# EAGLE design RasPi-BplusHAT (EAGLE 7.5.0)
PiHome Serial Gateway Header Schematic
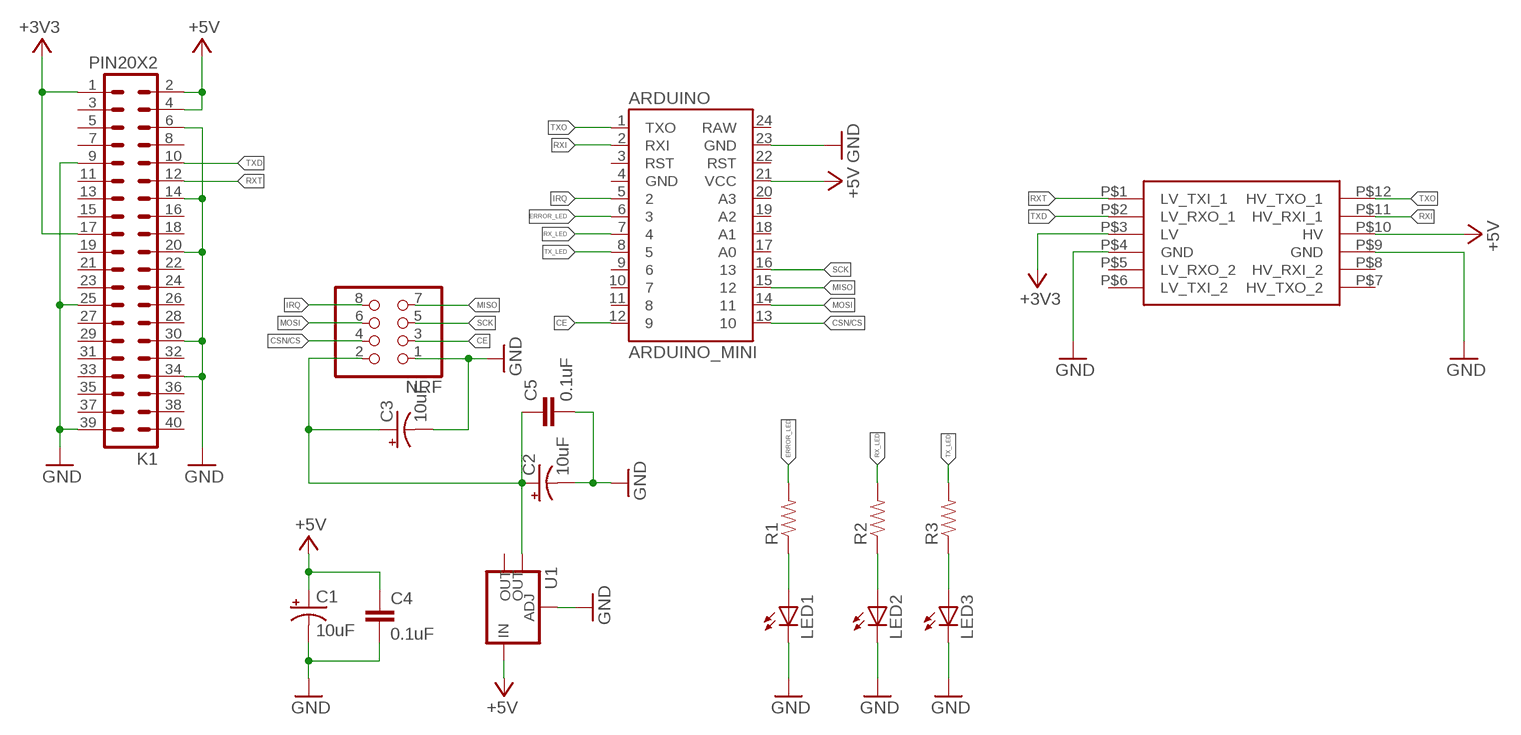
[diagram p0: schematic, sheet 1]

## Parts
ARDUINO  ARDUINO_MINI  [ARDUINO_MINI]
C1  10uF  CAP_POLPTH2  [CPOL-RADIAL-10UF-25V]
C2  10uF  CAP_POLPTH2  [CPOL-RADIAL-10UF-25V]
C3  10uF  CAP_POLPTH2  [CPOL-RADIAL-10UF-25V]
C4  0.1uF  CAPPTH  [CAP-PTH-SMALL]
C5  0.1uF  CAPPTH  [CAP-PTH-SMALL]
K1  PIN20X2  [PIN_20X2]
LED1  LED3MM  [LED3MM]
LED2  LED3MM  [LED3MM]
LED3  LED3MM  [LED3MM]
NRF  PINHD-2X4  [2X04]
R1  RESISTORPTH-1/4W  [AXIAL-0.4]
R2  RESISTORPTH-1/4W  [AXIAL-0.4]
R3  RESISTORPTH-1/4W  [AXIAL-0.4]
U1  V_REG_LM1117SOT223  [SOT223]
U$2  LOGIC_LEVEL_CONVERTER  [LOGIC_LEVEL_CONVERTER]

## Nets
+3V3: K1.1 K1.17 U$2.P$3(LV)
+5V: ARDUINO.21(VCC) C1.1(+) C4.1 K1.2 K1.4 U1.3(IN) U$2.P$10(HV)
CE: ARDUINO.12 NRF.3
CSN/CS: ARDUINO.13 NRF.4
ERROR_LED: ARDUINO.6 R1.P$2
GND: ARDUINO.23(GND) C1.2(-) C2.2(-) C3.2(-) C4.2 C5.2 K1.6 K1.9 K1.14 K1.20 K1.25 K1.30 K1.34 K1.39 LED1.K(C) LED2.K(C) LED3.K(C) NRF.1 U1.1(ADJ) U$2.P$4(GND) U$2.P$9(GND)
IRQ: ARDUINO.5 NRF.8
MISO: ARDUINO.15 NRF.7
MOSI: ARDUINO.14 NRF.6
N$1: C2.1(+) C3.1(+) C5.1 NRF.2 U1.4(OUT)
N$3: LED1.A R1.P$1
N$4: LED2.A R2.P$1
N$5: LED3.A R3.P$1
RX_LED: ARDUINO.7 R2.P$2
RXI: ARDUINO.2(RXI) U$2.P$11(HV_RXI_1)
RXT: K1.12 U$2.P$1(LV_TXI_1)
SCK: ARDUINO.16 NRF.5
TX_LED: ARDUINO.8 R3.P$2
TXD: K1.10 U$2.P$2(LV_RXO_1)
TXO: ARDUINO.1(TXO) U$2.P$12(HV_TXO_1)
Unconnected: ARDUINO.3(RST) ARDUINO.4(GND) ARDUINO.9 ARDUINO.10 ARDUINO.11 ARDUINO.17(A0) ARDUINO.18(A1) ARDUINO.19(A2) ARDUINO.20(A3) ARDUINO.22(RST) ARDUINO.24(RAW) K1.3 K1.5 K1.7 K1.8 K1.11 K1.13 K1.15 K1.16 K1.18 K1.19 K1.21 K1.22 K1.23 K1.24 K1.26 K1.27 K1.28 K1.29 K1.31 K1.32 K1.33 K1.35 K1.36 K1.37 K1.38 K1.40 U1.2(OUT) U$2.P$5(LV_RXO_2) U$2.P$6(LV_TXI_2) U$2.P$7(HV_TXO_2) U$2.P$8(HV_RXI_2)

## Library data of the parts
ARDUINO = SparkFun-Boards:ARDUINO_MINI: Arduino Pro Mini footprint
C1-C3 = SparkFun-Passives:CAP_POL: Capacitor Polarized These are standard SMD and PTH capacitors. Normally 10uF, 47uF, and 100uF in electrolytic and tantalum varieties. Always verify the external diameter of the through hole cap, it varies with capacity, voltage, and manufacturer. The EIA devices should be standard.
C4 C5 = SparkFun-Passives:CAP: Capacitor Standard 0603 ceramic capacitor, and 0.1" leaded capacitor.
K1 = FLYFISH:PIN20X2
LED1-LED3 = adafruit:LED: LED OSRAM: - CHIPLED LG R971, LG N971, LY N971, LG Q971, LY Q971, LO R971, LY R971 LH N974, LH R974 LS Q976, LO Q976, LY Q976 LO Q996 - Hyper CHIPLED LW Q18S LB Q993, LB Q99A, LB R99A - SideLED LS A670, LO A670, LY A670, LG A670, LP A670 LB A673, LV A673, LT A673, LW A673 LH A674 LY A675 LS A676, LA A676, LO A676, LY A676, LW A676 LS A679, LY A679, LG A679 - Hyper Micro SIDELED® LS Y876, LA Y876, LO Y876, LY Y876 LT Y87S - SmartLED LW L88C, LW L88S LB L89C, LB L89S, LG L890 LS L89K, LO L89K, LY L89K LS L896, LA L896, LO L896, LY L896 - TOPLED LS T670, LO T670, LY T670, LG T670, LP T670 LSG T670, LSP T670, LSY T670, LOP T670, LYG T670 LG T671, LOG T671, LSG T671 LB T673, LV T673, LT T673, LW T673 LH T674 LS T676, LA T676, LO T676, LY T676, LB T676, LH T676, LSB T676, LW T676 LB T67C, LV T67C, LT T67C, LS T67K, LO T67K, LY T67K, LW E67C LS E67B, LA E67B, LO E67B, LY E67B, LB E67C, LV E67C, LT E67C LW T67C LS T679, LY T679, LG T679 LS T770, LO T770, LY T770, LG T770, LP T770 LB T773, LV T773, LT T773, LW T773 LH T774 LS E675, LA E675, LY E675, LS T675 LS T776, LA T776, LO T776, LY T776, LB T776 LHGB T686 LT T68C, LB T68C - Hyper Mini TOPLED® LB M676 - Mini TOPLED Santana® LG M470 LS M47K, LO M47K, LY M47K Source: http://www.osram.convergy.de/
NRF = adafruit:PINHD-2X4: PIN HEADER
R1-R3 = SparkFun-Resistors:RESISTOR: Resistor Basic schematic elements and footprints for 0603, 1206, and PTH resistors.
U1 = SparkFun-PowerIC:V_REG_LM1117: Voltage Regulator LM1117 Standard adjustable voltage regulator but in SMD form. Spark Fun Electronics SKU : COM-00595; PROD_ID: VREG-08170
U$2 = SparkFun-Boards:LOGIC_LEVEL_CONVERTER: Logic Level Converter (3.3v - 5v) https://www.sparkfun.com/products/8745

## Board
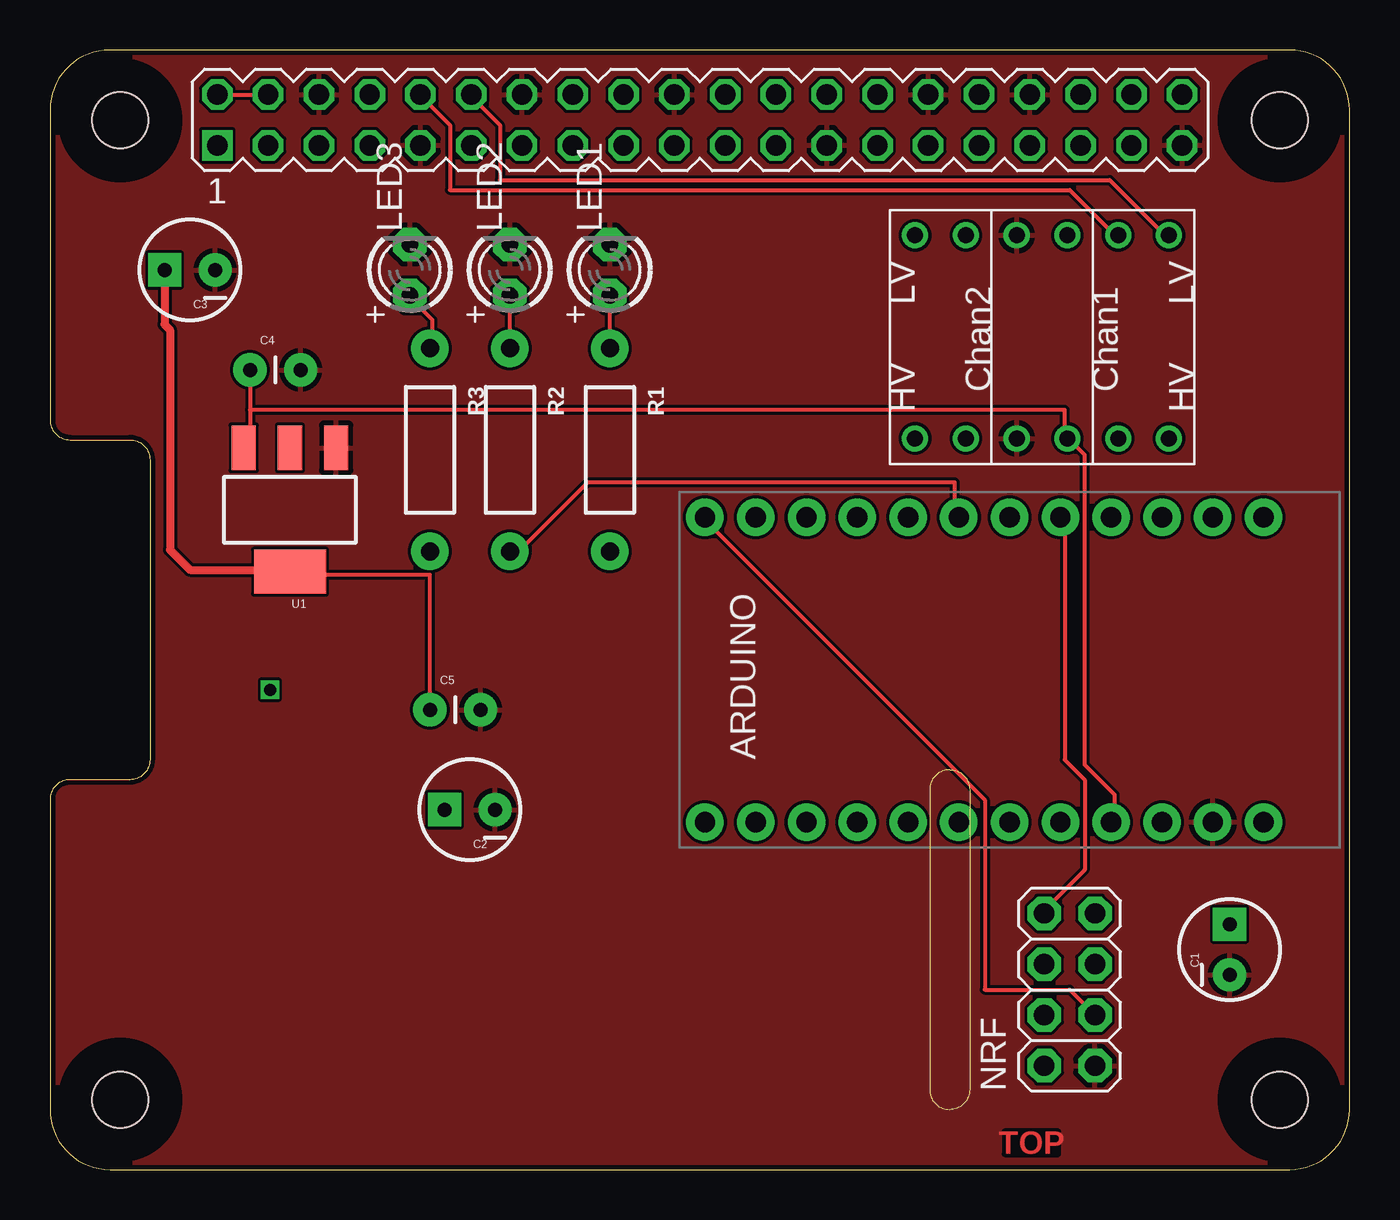
[diagram p1: board, top side]
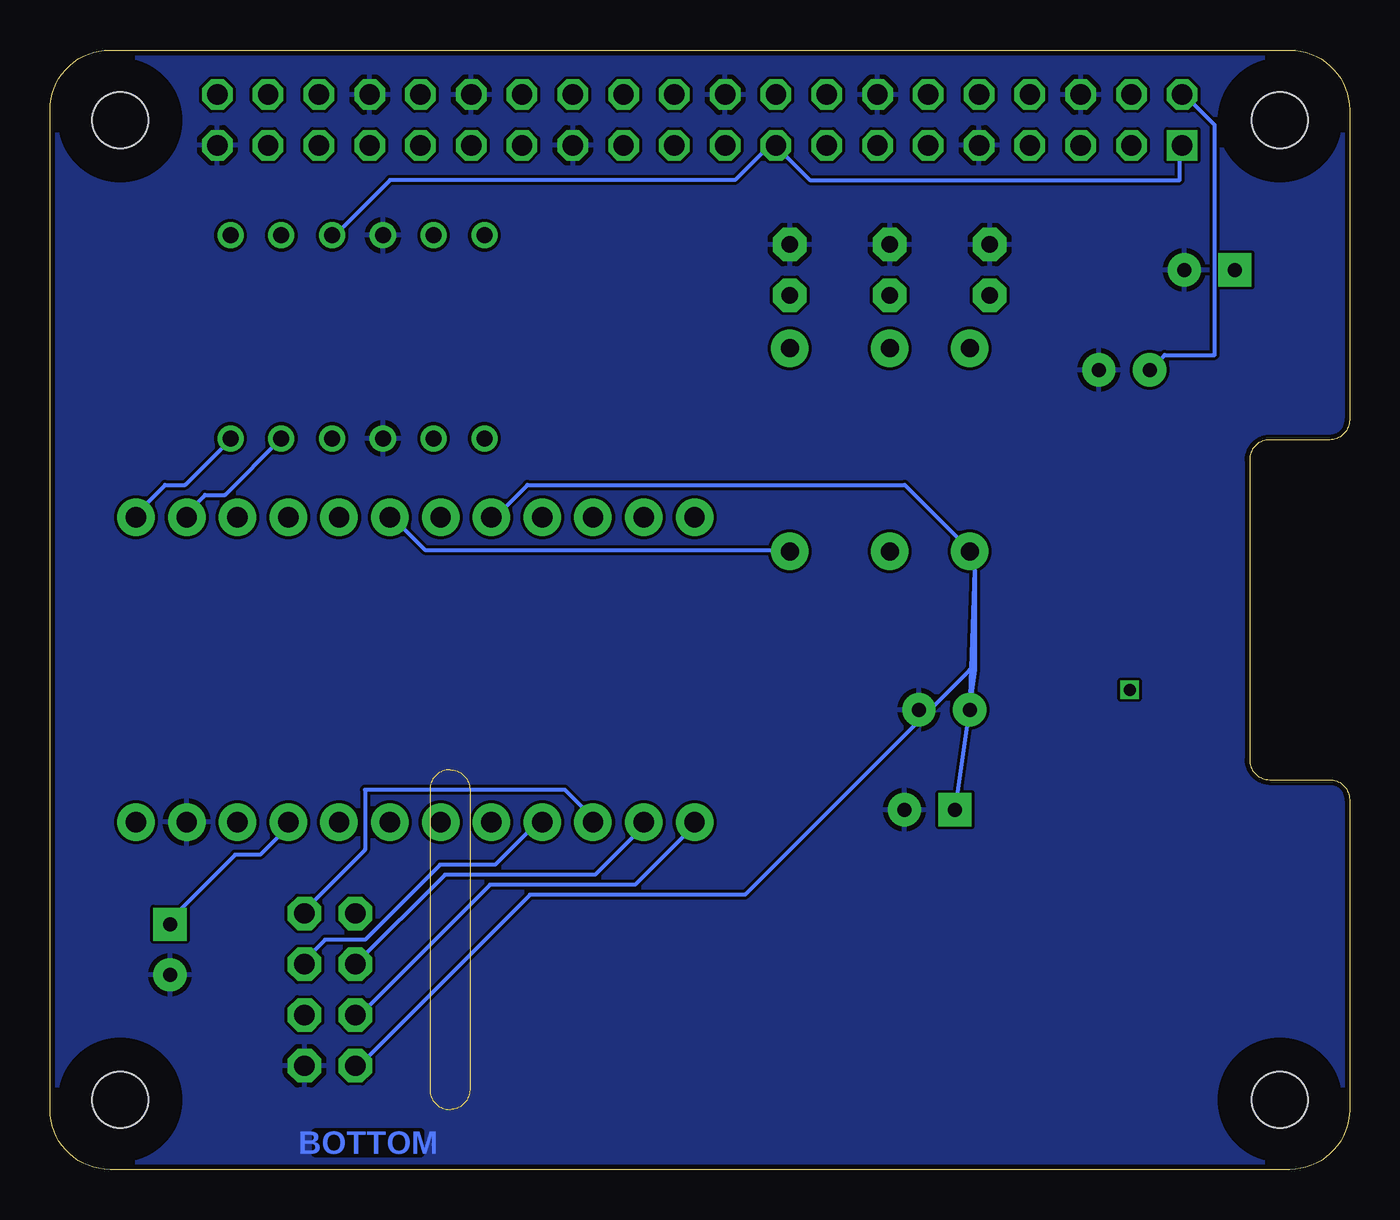
[diagram p2: board, bottom side, seen from below]

Size 65 x 56 mm. Coordinates in mm from the lower left corner, seen from the top.
Outline: 0,3 arc90 3,0 62,0 arc90 65,3 65,53 arc90 62,56 3,56 arc90 0,53 0,37.5 arc90 1,36.5 4,36.5 arc-90 5,35.5 5,20.5 arc-90 4,19.5 1,19.5 arc90 0,18.5 0,3
Copper layers (1*16): Top 0.035mm / dielectric 1.5mm / Bottom 0.035mm
Design rules "ITEADstudio_DRC *": minimum track width 8mil, minimum drill 12mil, track to track 6mil, track to pad 6mil, pad to pad 6mil, via to via 6mil, smd to smd 0mil, copper to edge 10mil, drill to drill 10mil, minimum pad ring 10mil, minimum via ring 6mil, stop-mask expansion 2mil, vias tented up to drill 100mil, thermal gap 10mil
Holes 2.8 mm at 3.5,3.5 3.5,52.5 61.5,52.5 61.5,3.5
tRestrict: area 1.9,51 to 5,54; area 60,51 to 63,54; area 60,1.9 to 63,5; area 1.9,1.9 to 5,5
bRestrict: area 1.9,1.9 to 5,5; area 1.9,51 to 5,54; area 60,1.9 to 63,5; area 60,51 to 63,54
Milling: 6 lines

### Footprints (pad centres in the part's own frame; a part is rotated, then mirrored left to right if it is on the bottom)
ARDUINO_MINI = drill 1.016 pad 1.88: 1 -7.62,12.7; 2 -7.62,10.16; 3 -7.62,7.62; 4 -7.62,5.08; 5 -7.62,2.54; 6 -7.62,0; 7 -7.62,-2.54; 8 -7.62,-5.08; 9 -7.62,-7.62; 10 -7.62,-10.16; 11 -7.62,-12.7; 12 -7.62,-15.24; 13 7.62,-15.24; 14 7.62,-12.7; 15 7.62,-10.16; 16 7.62,-7.62; 17 7.62,-5.08; 18 7.62,-2.54; 19 7.62,0; 20 7.62,2.54; 21 7.62,5.08; 22 7.62,7.62; 23 7.62,10.16; 24 7.62,12.7
CPOL-RADIAL-10UF-25V = drill 0.7 pad 1.651 square: 1 1.27,0 | drill 0.7 pad 1.651: 2 -1.27,0
CAP-PTH-SMALL = drill 0.7 pad 1.651: 1 0,0; 2 2.54,0
PIN_20X2 = drill 1.016 square: 1 -24.13,-1.27 | drill 1.016 octagon: 2 -24.13,1.27; 3 -21.59,-1.27; 4 -21.59,1.27; 5 -19.05,-1.27; 6 -19.05,1.27; 7 -16.51,-1.27; 8 -16.51,1.27; 9 -13.97,-1.27; 10 -13.97,1.27; 11 -11.43,-1.27; 12 -11.43,1.27; 13 -8.89,-1.27; 14 -8.89,1.27; 15 -6.35,-1.27; 16 -6.35,1.27; 17 -3.81,-1.27; 18 -3.81,1.27; 19 -1.27,-1.27; 20 -1.27,1.27; 21 1.27,-1.27; 22 1.27,1.27; 23 3.81,-1.27; 24 3.81,1.27; 25 6.35,-1.27; 26 6.35,1.27; 27 8.89,-1.27; 28 8.89,1.27; 29 11.43,-1.27; 30 11.43,1.27; 31 13.97,-1.27; 32 13.97,1.27; 33 16.51,-1.27; 34 16.51,1.27; 35 19.05,-1.27; 36 19.05,1.27; 37 21.59,-1.27; 38 21.59,1.27; 39 24.13,-1.27; 40 24.13,1.27
LED3MM = drill 0.813 pad 1.676 octagon: A -1.27,0; K 1.27,0
2X04 = drill 1.016 pad 1.676 octagon: 1 -3.81,-1.27; 2 -3.81,1.27; 3 -1.27,-1.27; 4 -1.27,1.27; 5 1.27,-1.27; 6 1.27,1.27; 7 3.81,-1.27; 8 3.81,1.27
AXIAL-0.4 = drill 0.9 pad 1.88: P$1 -5.08,0; P$2 5.08,0
SOT223 = smd 1.219 x 2.235: 1 -2.311,-3.099; 2 0,-3.099; 3 2.311,-3.099 | smd 3.6 x 2.2: 4 0,3.099
LOGIC_LEVEL_CONVERTER = drill 0.8: P$1 1.27,13.97; P$2 1.27,11.43; P$3 1.27,8.89; P$4 1.27,6.35; P$5 1.27,3.81; P$6 1.27,1.27; P$7 11.43,1.27; P$8 11.43,3.81; P$9 11.43,6.35; P$10 11.43,8.89; P$11 11.43,11.43; P$12 11.43,13.97

### Placement (x,y rotation side)
ARDUINO  48,25 270 top
C1  59,11 90 top
C2  21,18 180 top
C3  7,45 180 top
C4  10,40 0 top
C5  19,23 0 top
K1  32.5,52.5 0 top
LED1  28,45 90 top
LED2  23,45 90 top
LED3  18,45 90 top
NRF  51,9 90 top
R1  28,36 270 top
R2  23,36 270 top
R3  19,36 270 top
U1  12,33 180 top
U$2  42,48 270 top

### Tracks (layer width: path | path; a pad name or v marks a point on that pad's centre or on a via)
+3V3
  Bottom 0.203: U$2.P$3 50.75,46.75 48,49.5 30.75,49.5 29.25,51 28.75,51 K1.17 28.5,51 27,49.5 8.5,49.5 8.5,51 K1.1
+5V
  Top 0.203: K1.2 8.5,53.75 10.75,53.75 K1.4 | C4.1 10,38 | 10,38 10,36.5 9.75,36.25 U1.3 | ARDUINO.21 53.25,17.5 53.25,18.75 51.75,20.25 51.75,35.75 51,36.5 U$2.P$10 50.75,36.75 50.75,38 10,38
  Bottom 0.203: C4.1 9.25,40.75 6.75,40.75 6.75,52.25 8.25,53.75 K1.2 | C1.1 59,12.5 55.75,15.75 54.5,15.75 53,17.25 ARDUINO.21
CE
  Top 0.203: NRF.3 51,9 46.75,9 46.75,18.5 33,32.25 33,32.5 ARDUINO.12
CSN/CS
  Bottom 0.203: NRF.4 49.5,7.75 43,14.25 35.75,14.25 32.75,17.25 ARDUINO.13
ERROR_LED
  Bottom 0.203: R1.P$2 28,31 46.25,31 47.75,32.5 48,32.5 ARDUINO.6
GND
  pour Bottom: 0,3 arc90 3,0 62,0 arc90 65,3 65,53 arc90 62,56 3,56 arc90 0,53 0,37.5 arc90 1,36.5 4,36.5 arc-90 5,35.5 5,20.5 arc-90 4,19.5 1,19.5 arc90 0,18.5
  pour Top: 0,3 arc90 3,0 62,0 arc90 65,3 65,53 arc90 62,56 3,56 arc90 0,53 0,37.5 arc90 1,36.5 4,36.5 arc-90 5,35.5 5,20.5 arc-90 4,19.5 1,19.5 arc90 0,18.5
IRQ
  Top 0.203: NRF.8 49.75,13 51.75,15 51.75,19.5 50.75,20.5 50.75,32.5 ARDUINO.5
MISO
  Bottom 0.203: NRF.7 52.25,13 49.25,16 49.25,19 39.25,19 37.75,17.5 ARDUINO.15
MOSI
  Bottom 0.203: NRF.6 45.25,14.75 37.75,14.75 35.25,17.25 ARDUINO.14
N$1
  Top 0.152: 11.89,30.02 U1.4
  Top 0.203: C5.1 19,29.75 12,29.75 U1.4
  Top 0.406: C3.1 5.73,42.27 6,42 6,31 7,30 11.9,30 U1.4
  Bottom 0.203: 18.75,25 18.75,30 C5.1 | 18.75,25 19,25 30.25,13.75 41,13.75 49.5,5.25 NRF.2 | 18.75,25 C2.1
N$2  (via drill 0.6)
  other vias: 11,24
N$3
  Top 0.203: R1.P$1 LED1.A
N$4
  Top 0.203: R2.P$1 LED2.A
N$5
  Top 0.203: LED3.A 18,43.62 19.12,42.5 19.12,41.25 19,41.12 R3.P$1
RX_LED
  Top 0.203: R2.P$2 23,31 23.75,31 23.75,31.25 26.88,34.38 45.25,34.38 45.25,32.75 45.38,32.62 ARDUINO.7
RXI
  Bottom 0.203: U$2.P$11 56.25,33.75 57.25,33.75 58.25,32.75 ARDUINO.2
RXT
  Top 0.203: U$2.P$1 55.75,46.75 53,49.5 22.5,49.5 22.5,52.25 21.25,53.5 21.25,53.75 K1.12
SCK
  Bottom 0.203: NRF.5 52.25,10.5 51.25,11.5 49.25,11.5 45.5,15.25 42.75,15.25 40.75,17.25 40.5,17.25 ARDUINO.16
TX_LED
  Bottom 0.203: R3.P$2 19,31 22.25,34.25 41.12,34.25 42.75,32.62 42.88,32.62 ARDUINO.8
TXD
  Top 0.203: U$2.P$2 53.25,46.75 51,49 20,49 20,52.25 18.75,53.5 18.75,53.75 K1.10
TXO
  Bottom 0.203: U$2.P$12 56,36.5 58.25,34.25 59.25,34.25 60.75,32.75 ARDUINO.1

### Text on the board
Top: TOP
Bottom: BOTTOM